# Altium schematic sheet CATS-EUROC-IMU.SchDoc: CATS EuRoC Edition
size A4; DocumentNumber: Overview; Revision: V1.0; SheetNumber: 6; SheetTotal: 16; Author: Luca Jost; Subtitle: Inertial Measurement Unit
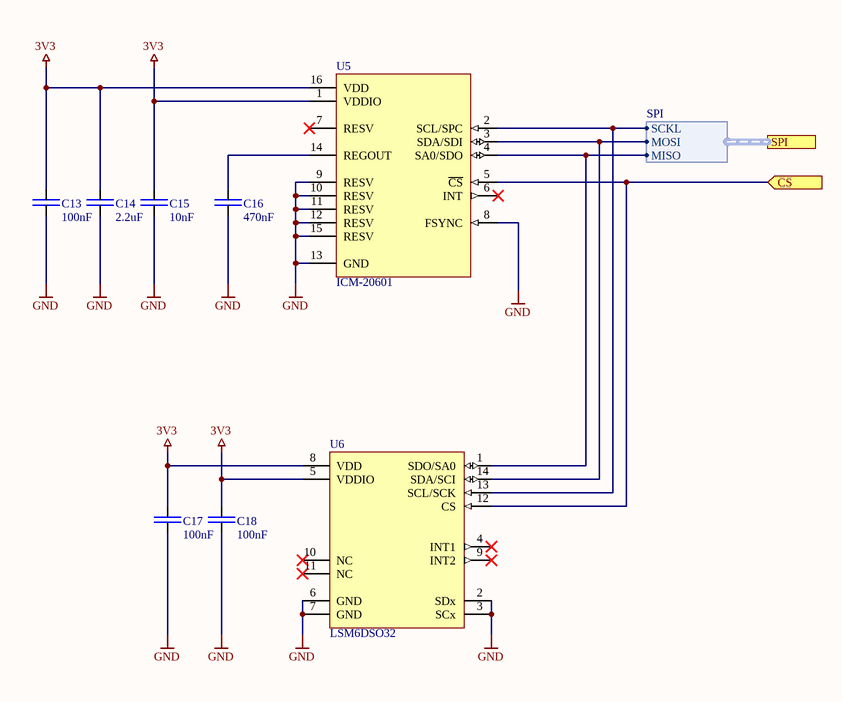
[diagram p0: CATS-EUROC-IMU.SchDoc]

## Parts
C13  100nF  [SMD Keramikkondensator 0402]
C14  2.2uF  [SMD Keramikkondensator 0402]
C15  10nF  [SMD Keramikkondensator 0402]
C16  470nF  [SMD Keramikkondensator 0402]
C17  100nF  [SMD Keramikkondensator 0402]
C18  100nF  [SMD Keramikkondensator 0402]
U5  ICM-20601  [SMD IC LGA-16 5/3]
U6  LSM6DSO32  [SMD IC LGA-14]

## Ports
CS (in), SPI (harness SPI)

## Harnesses
SPI: SCKL, MOSI, MISO

## Nets
3V3: C13.2 C14.2 C15.2 C17.2 C18.2 U5.1(VDDIO) U5.16(VDD) U6.5(VDDIO) U6.8(VDD)
GND: C13.1 C14.1 C15.1 C16.1 C17.1 C18.1 U5.8(FSYNC) U5.9(RESV) U5.10(RESV) U5.11(RESV) U5.12(RESV) U5.13(GND) U5.15(RESV) U6.2(SDx) U6.3(SCx) U6.6(GND) U6.7(GND)
CS: U5.5(~{CS}) U6.12(CS) ; port CS
NetC16_2: C16.2 U5.14(REGOUT)
NetU5_2: U5.2(SCL/SPC) U6.13(SCL/SCK) ; port SPI.SCKL
NetU5_3: U5.3(SDA/SDI) U6.14(SDA/SCI) ; port SPI.MOSI
NetU5_4: U5.4(SA0/SDO) U6.1(SDO/SA0) ; port SPI.MISO

Not connected (* = marked no-connect by the designer): U5 6(INT)* 7(RESV)*; U6 4(INT1)* 9(INT2)* 10(NC)* 11(NC)*

## Notes on the sheet
- Title
- Author:
- Subtitle
- Date:
- Rev:
- File:
- Sheet
- of

## Library data of the parts
C13 C17 C18 = E6 - 100nF: SMD Ceramic Capacitor E6; Unit Price: 0.01; Number: -; Supplier: -; JLC: C307331
C14 = E6 - 2.2uF: SMD Ceramic Capacitor E6; Unit Price: 0.01; Number: -; Supplier: -; JLC: C12530
C15 = E6 - 10nF: SMD Ceramic Capacitor E6; Unit Price: 0.01; Number: -; Supplier: -; JLC: C15195
C16 = E6 - 470nF: SMD Ceramic Capacitor E6; Unit Price: 0.01; Number: -; Supplier: -; JLC: C47339
U5 = ICM-20601: World’s First Wide-Range 6-Axis MotionTracking Device for High Speed Applications /; ComponentLink1Description: Datasheet; ComponentLink1URL: https://www.invensense.com/wp-content/uploads/2015/12/DS-000184-ICM-20600-v1.0.pdf; Digikey: 1428-1058-1-ND
U6 = LSM6DSO32: iNEMO inertial module / ±4/±8/±16/±32 g / ±125/±250/±500/±1000/±2000 dps; ComponentLink1Description: Datasheet; ComponentLink1URL: https://www.st.com/resource/en/datasheet/lsm6dso32.pdf; Digikey: 497-LSM6DSO32CT-ND; Mouser: 511-LSM6DSO32TR; Farnell: 3527117